# Altium schematic sheet Power_3_3_module.SchDoc
size A
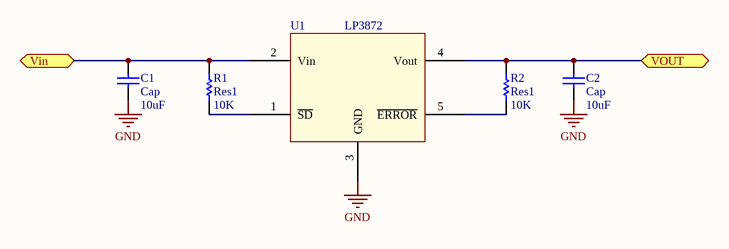
[diagram p0: Power_3_3_module.SchDoc]

## Parts
C1  Cap  value 10uF  [RESC6332]
C2  Cap  value 10uF  [RESC6332]
R1  Res1  value 10K  [RESC6332]
R2  Res1  value 10K  [RESC6332]
U1  LP3872  [SOT150P700X180-5N]

## Ports
Vin, VOUT

## Nets
GND: C1.2 C2.2 U1.3(GND)
Vin: C1.1 R1.2 U1.2(Vin) ; port Vin
VOUT: C2.1 R2.2 U1.4(Vout) ; port VOUT
NetR1_1: R1.1 U1.1(~{SD})
NetR2_1: R2.1 U1.5(~{ERROR})

## Library data of the parts
C1 C2 = Cap: Capacitor; Published: 8-Jun-2000; LatestRevisionDate: 17-Jul-2002; LatestRevisionNote: Re-released for DXP Platform.; PackageReference: RAD-0.3; Publisher: Altium Limited; PackageDescription: Radial Cap, Thru-Hole; 2 Leads; 0.3 in Pin Spacing
R1 R2 = Res1: Resistor; Published: 8-Jun-2000; LatestRevisionDate: 17-Jul-2002; LatestRevisionNote: Re-released for DXP Platform.; PackageReference: AXIAL-0.3; Publisher: Altium Limited; PackageDescription: Axial Device, Thru-Hole; 2 Leads; 0.3 in Pin Spacing